# Altium schematic sheet DDR_Memory.SchDoc: DDR Memory
size A3; GitHash: VersionControl_ProjFolderRevNumber; Author: Carlos Barreiro; Organization: Escuela Técnica Superior de Ingeniería de Sistemas Informáticos de la Universidad Politécnica de Madrid; Address1: Campus Sur de la Universidad Politécnica de Madrid; Address2: Calle de Alan Turing, s/nº; Address3: Madrid 28031; Address4: España; Revision: 1.0; SheetNumber: 4; SheetTotal: 5
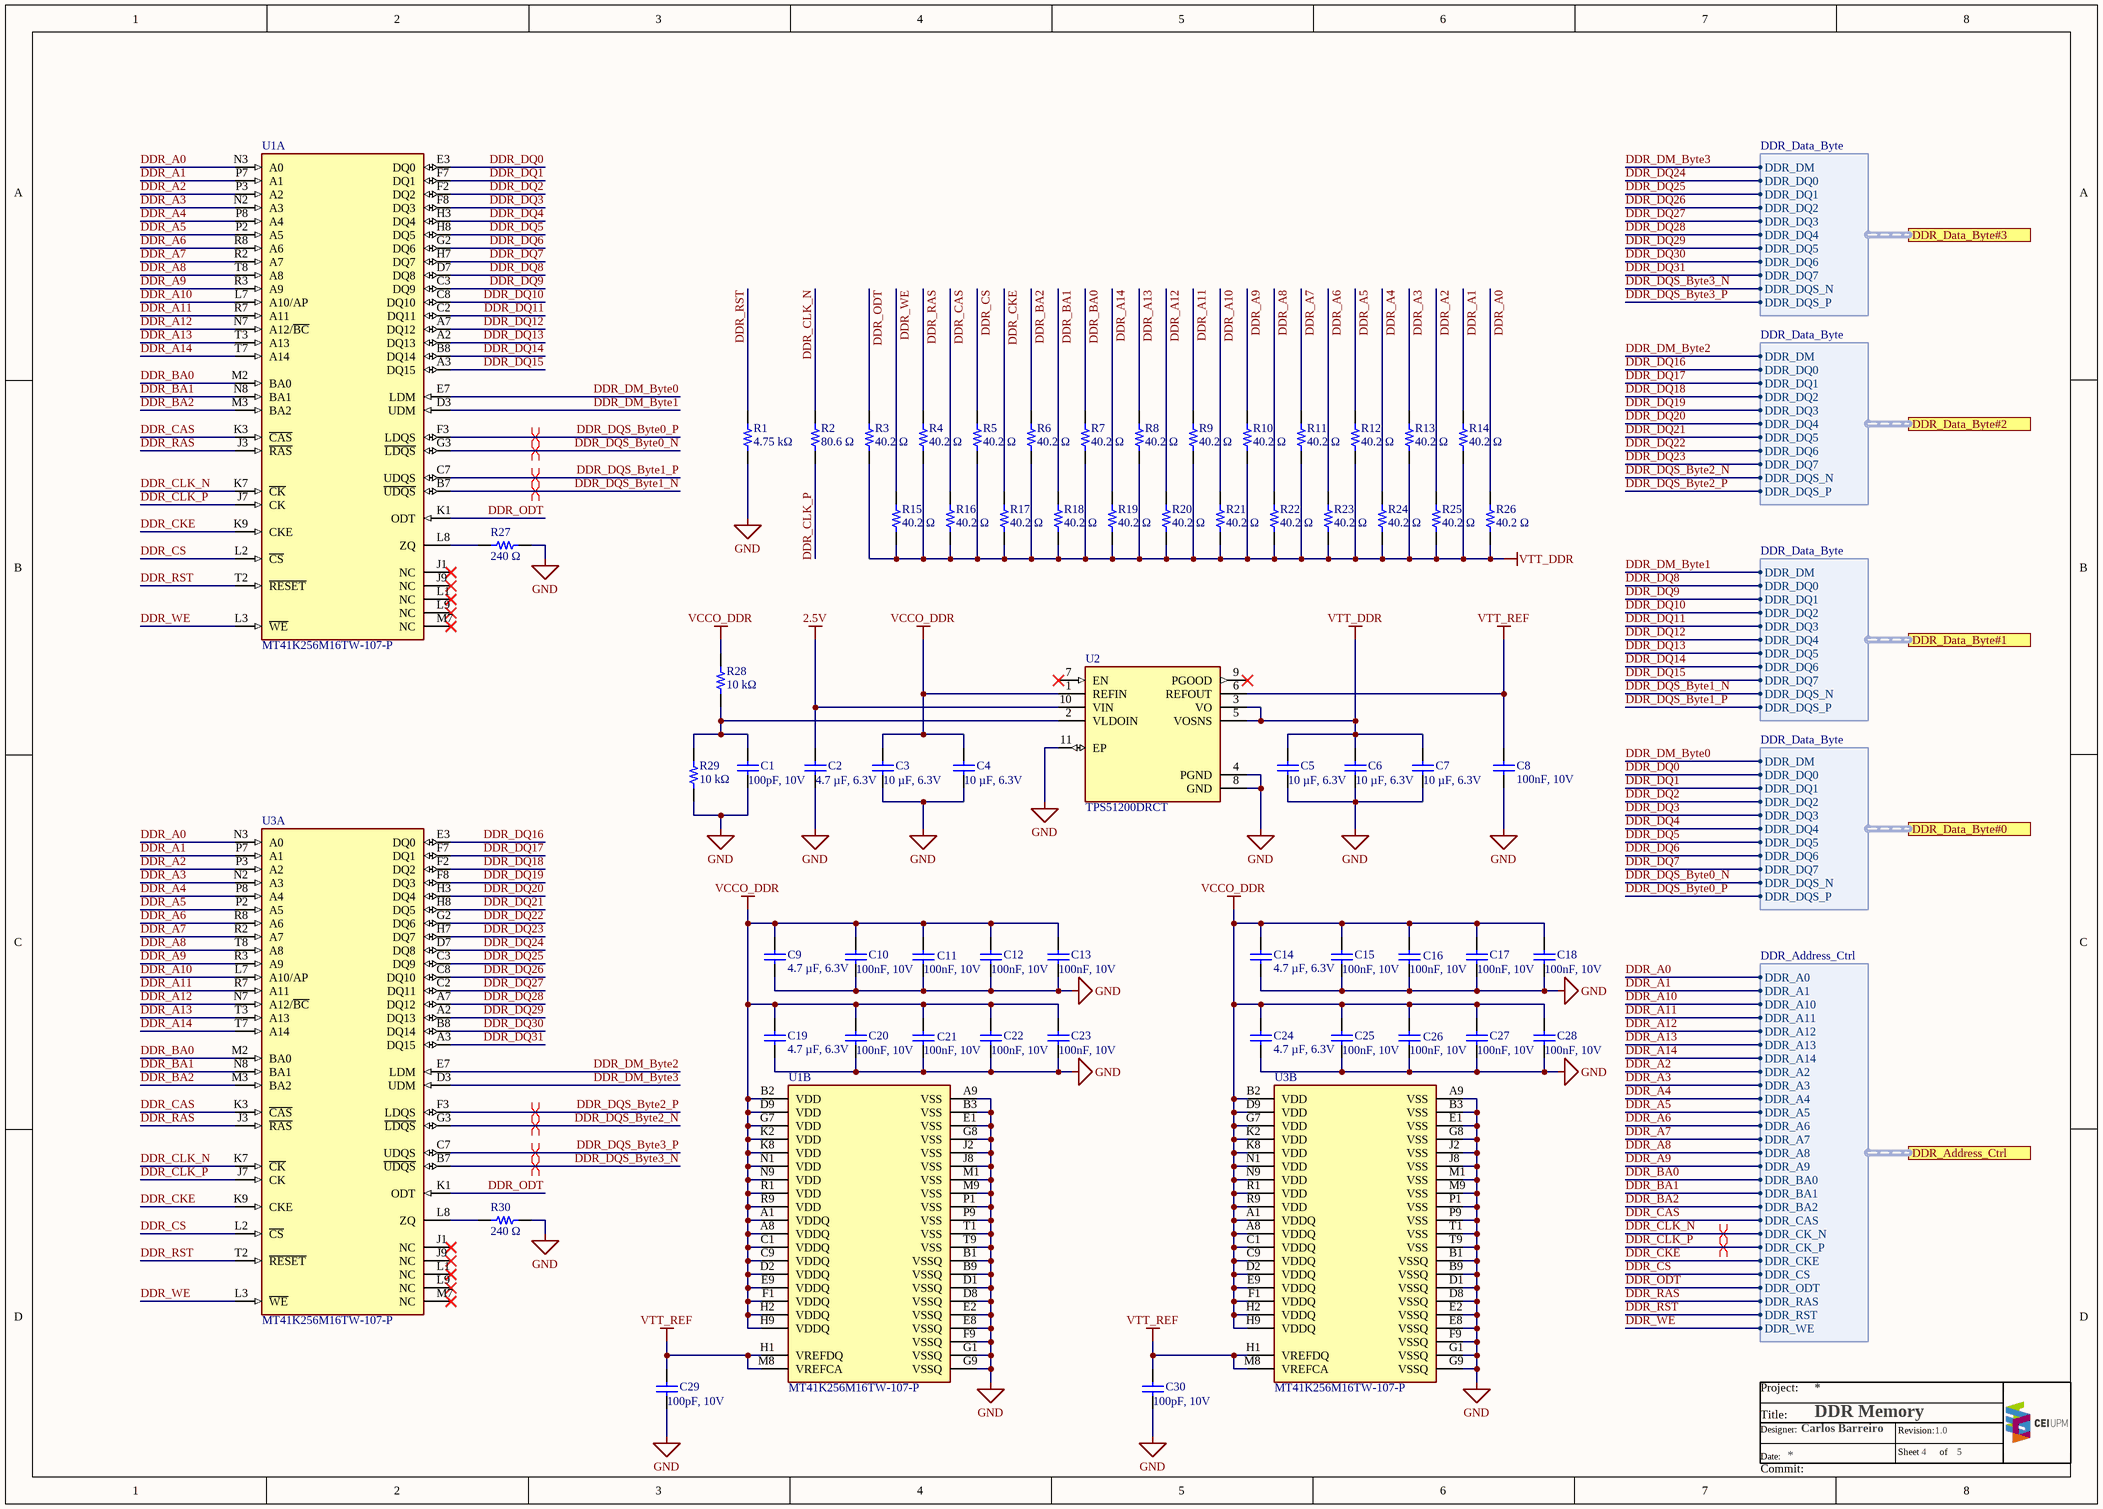
[diagram p0: DDR_Memory.SchDoc]

## Parts
C1  100pF, 10V  [WURTH_WCAP-CSGP_0402]
C2  4.7 µF, 6.3V  [WURTH_WCAP-CSGP_0402]
C3  10 µF, 6.3V  [WURTH_WCAP-CSGP_0402]
C4  10 µF, 6.3V  [WURTH_WCAP-CSGP_0402]
C5  10 µF, 6.3V  [WURTH_WCAP-CSGP_0402]
C6  10 µF, 6.3V  [WURTH_WCAP-CSGP_0402]
C7  10 µF, 6.3V  [WURTH_WCAP-CSGP_0402]
C8  100nF, 10V  [WURTH_WCAP-CSGP_0402]
C9  4.7 µF, 6.3V  [WURTH_WCAP-CSGP_0402]
C10  100nF, 10V  [WURTH_WCAP-CSGP_0402]
C11  100nF, 10V  [WURTH_WCAP-CSGP_0402]
C12  100nF, 10V  [WURTH_WCAP-CSGP_0402]
C13  100nF, 10V  [WURTH_WCAP-CSGP_0402]
C14  4.7 µF, 6.3V  [WURTH_WCAP-CSGP_0402]
C15  100nF, 10V  [WURTH_WCAP-CSGP_0402]
C16  100nF, 10V  [WURTH_WCAP-CSGP_0402]
C17  100nF, 10V  [WURTH_WCAP-CSGP_0402]
C18  100nF, 10V  [WURTH_WCAP-CSGP_0402]
C19  4.7 µF, 6.3V  [WURTH_WCAP-CSGP_0402]
C20  100nF, 10V  [WURTH_WCAP-CSGP_0402]
C21  100nF, 10V  [WURTH_WCAP-CSGP_0402]
C22  100nF, 10V  [WURTH_WCAP-CSGP_0402]
C23  100nF, 10V  [WURTH_WCAP-CSGP_0402]
C24  4.7 µF, 6.3V  [WURTH_WCAP-CSGP_0402]
C25  100nF, 10V  [WURTH_WCAP-CSGP_0402]
C26  100nF, 10V  [WURTH_WCAP-CSGP_0402]
C27  100nF, 10V  [WURTH_WCAP-CSGP_0402]
C28  100nF, 10V  [WURTH_WCAP-CSGP_0402]
C29  100pF, 10V  [WURTH_WCAP-CSGP_0402]
C30  100pF, 10V  [WURTH_WCAP-CSGP_0402]
R1  4.75 kΩ  [PANASONIC_ERJ2G_0402]
R2  80.6 Ω  [PANASONIC_ERJ2G_0402]
R3  40.2 Ω  [PANASONIC_ERJ2G_0402]
R4  40.2 Ω  [PANASONIC_ERJ2G_0402]
R5  40.2 Ω  [PANASONIC_ERJ2G_0402]
R6  40.2 Ω  [PANASONIC_ERJ2G_0402]
R7  40.2 Ω  [PANASONIC_ERJ2G_0402]
R8  40.2 Ω  [PANASONIC_ERJ2G_0402]
R9  40.2 Ω  [PANASONIC_ERJ2G_0402]
R10  40.2 Ω  [PANASONIC_ERJ2G_0402]
R11  40.2 Ω  [PANASONIC_ERJ2G_0402]
R12  40.2 Ω  [PANASONIC_ERJ2G_0402]
R13  40.2 Ω  [PANASONIC_ERJ2G_0402]
R14  40.2 Ω  [PANASONIC_ERJ2G_0402]
R15  40.2 Ω  [PANASONIC_ERJ2G_0402]
R16  40.2 Ω  [PANASONIC_ERJ2G_0402]
R17  40.2 Ω  [PANASONIC_ERJ2G_0402]
R18  40.2 Ω  [PANASONIC_ERJ2G_0402]
R19  40.2 Ω  [PANASONIC_ERJ2G_0402]
R20  40.2 Ω  [PANASONIC_ERJ2G_0402]
R21  40.2 Ω  [PANASONIC_ERJ2G_0402]
R22  40.2 Ω  [PANASONIC_ERJ2G_0402]
R23  40.2 Ω  [PANASONIC_ERJ2G_0402]
R24  40.2 Ω  [PANASONIC_ERJ2G_0402]
R25  40.2 Ω  [PANASONIC_ERJ2G_0402]
R26  40.2 Ω  [PANASONIC_ERJ2G_0402]
R27  240 Ω  [PANASONIC_ERJ2G_0402]
R28  10 kΩ  [PANASONIC_ERJ2G_0402]
R29  10 kΩ  [PANASONIC_ERJ2G_0402]
R30  240 Ω  [PANASONIC_ERJ2G_0402]
U1  MT41K256M16TW-107-P  [Micron_TW]  (parts A,B of 2)
U2  TPS51200DRCT  [TEXAS_VSON10]
U3  MT41K256M16TW-107-P  [Micron_TW]  (parts A,B of 2)

## Ports
DDR_Address_Ctrl (harness DDR_Address_Ctrl), DDR_Data_Byte#0 (harness DDR_Data_Byte), DDR_Data_Byte#1 (harness DDR_Data_Byte), DDR_Data_Byte#2 (harness DDR_Data_Byte), DDR_Data_Byte#3 (harness DDR_Data_Byte)

## Harnesses
DDR_Address_Ctrl: DDR_A0, DDR_A1, DDR_A10, DDR_A11, DDR_A12, DDR_A13, DDR_A14, DDR_A2, DDR_A3, DDR_A4, DDR_A5, DDR_A6, DDR_A7, DDR_A8, DDR_A9, DDR_BA0, DDR_BA1, DDR_BA2, DDR_CAS, DDR_CK_N, DDR_CK_P, DDR_CKE, DDR_CS, DDR_ODT, DDR_RAS, DDR_RST, DDR_WE
DDR_Data_Byte: DDR_DM, DDR_DQ0, DDR_DQ1, DDR_DQ2, DDR_DQ3, DDR_DQ4, DDR_DQ5, DDR_DQ6, DDR_DQ7, DDR_DQS_N, DDR_DQS_P

## Nets
2.5V: C2.2 U2.10(VIN)
GND: C1.1 C2.1 C3.1 C4.1 C5.1 C6.1 C7.1 C8.1 C9.1 C10.1 C11.1 C12.1 C13.1 C14.1 C15.1 C16.1 C17.1 C18.1 C19.1 C20.1 C21.1 C22.1 C23.1 C24.1 C25.1 C26.1 C27.1 C28.1 C29.1 C30.1 R1.2 R27.2 R29.1 R30.2 U1.A9(VSS) U1.B1(VSSQ) U1.B3(VSS) U1.B9(VSSQ) U1.D1(VSSQ) U1.D8(VSSQ) U1.E1(VSS) U1.E2(VSSQ) U1.E8(VSSQ) U1.F9(VSSQ) U1.G1(VSSQ) U1.G8(VSS) U1.G9(VSSQ) U1.J2(VSS) U1.J8(VSS) U1.M1(VSS) U1.M9(VSS) U1.P1(VSS) U1.P9(VSS) U1.T1(VSS) U1.T9(VSS) U2.4(PGND) U2.8(GND) U2.11(EP) U3.A9(VSS) U3.B1(VSSQ) U3.B3(VSS) U3.B9(VSSQ) U3.D1(VSSQ) U3.D8(VSSQ) U3.E1(VSS) U3.E2(VSSQ) U3.E8(VSSQ) U3.F9(VSSQ) U3.G1(VSSQ) U3.G8(VSS) U3.G9(VSSQ) U3.J2(VSS) U3.J8(VSS) U3.M1(VSS) U3.M9(VSS) U3.P1(VSS) U3.P9(VSS) U3.T1(VSS) U3.T9(VSS)
VCCO_DDR: C3.2 C4.2 C9.2 C10.2 C11.2 C12.2 C13.2 C14.2 C15.2 C16.2 C17.2 C18.2 C19.2 C20.2 C21.2 C22.2 C23.2 C24.2 C25.2 C26.2 C27.2 C28.2 R28.2 U1.A1(VDDQ) U1.A8(VDDQ) U1.B2(VDD) U1.C1(VDDQ) U1.C9(VDDQ) U1.D2(VDDQ) U1.D9(VDD) U1.E9(VDDQ) U1.F1(VDDQ) U1.G7(VDD) U1.H2(VDDQ) U1.H9(VDDQ) U1.K2(VDD) U1.K8(VDD) U1.N1(VDD) U1.N9(VDD) U1.R1(VDD) U1.R9(VDD) U2.1(REFIN) U3.A1(VDDQ) U3.A8(VDDQ) U3.B2(VDD) U3.C1(VDDQ) U3.C9(VDDQ) U3.D2(VDDQ) U3.D9(VDD) U3.E9(VDDQ) U3.F1(VDDQ) U3.G7(VDD) U3.H2(VDDQ) U3.H9(VDDQ) U3.K2(VDD) U3.K8(VDD) U3.N1(VDD) U3.N9(VDD) U3.R1(VDD) U3.R9(VDD)
VTT_DDR: C5.2 C6.2 C7.2 R3.2 R4.2 R5.2 R6.2 R7.2 R8.2 R9.2 R10.2 R11.2 R12.2 R13.2 R14.2 R15.2 R16.2 R17.2 R18.2 R19.2 R20.2 R21.2 R22.2 R23.2 R24.2 R25.2 R26.2 U2.3(VO) U2.5(VOSNS)
VTT_REF: C8.2 C29.2 C30.2 U1.H1(VREFDQ) U1.M8(VREFCA) U2.6(REFOUT) U3.H1(VREFDQ) U3.M8(VREFCA)
DDR_A0: R26.1 U1.N3(A0) U3.N3(A0) ; port DDR_Address_Ctrl.DDR_A0
DDR_A1: R14.1 U1.P7(A1) U3.P7(A1) ; port DDR_Address_Ctrl.DDR_A1
DDR_A2: R25.1 U1.P3(A2) U3.P3(A2) ; port DDR_Address_Ctrl.DDR_A2
DDR_A3: R13.1 U1.N2(A3) U3.N2(A3) ; port DDR_Address_Ctrl.DDR_A3
DDR_A4: R24.1 U1.P8(A4) U3.P8(A4) ; port DDR_Address_Ctrl.DDR_A4
DDR_A5: R12.1 U1.P2(A5) U3.P2(A5) ; port DDR_Address_Ctrl.DDR_A5
DDR_A6: R23.1 U1.R8(A6) U3.R8(A6) ; port DDR_Address_Ctrl.DDR_A6
DDR_A7: R11.1 U1.R2(A7) U3.R2(A7) ; port DDR_Address_Ctrl.DDR_A7
DDR_A8: R22.1 U1.T8(A8) U3.T8(A8) ; port DDR_Address_Ctrl.DDR_A8
DDR_A9: R10.1 U1.R3(A9) U3.R3(A9) ; port DDR_Address_Ctrl.DDR_A9
DDR_A10: R21.1 U1.L7(A10/AP) U3.L7(A10/AP) ; port DDR_Address_Ctrl.DDR_A10
DDR_A11: R9.1 U1.R7(A11) U3.R7(A11) ; port DDR_Address_Ctrl.DDR_A11
DDR_A12: R20.1 U1.N7(A12/~{BC}) U3.N7(A12/~{BC}) ; port DDR_Address_Ctrl.DDR_A12
DDR_A13: R8.1 U1.T3(A13) U3.T3(A13) ; port DDR_Address_Ctrl.DDR_A13
DDR_A14: R19.1 U1.T7(A14) U3.T7(A14) ; port DDR_Address_Ctrl.DDR_A14
DDR_BA0: R7.1 U1.M2(BA0) U3.M2(BA0) ; port DDR_Address_Ctrl.DDR_BA0
DDR_BA1: R18.1 U1.N8(BA1) U3.N8(BA1) ; port DDR_Address_Ctrl.DDR_BA1
DDR_BA2: R6.1 U1.M3(BA2) U3.M3(BA2) ; port DDR_Address_Ctrl.DDR_BA2
DDR_CAS: R16.1 U1.K3(~{CAS}) U3.K3(~{CAS}) ; port DDR_Address_Ctrl.DDR_CAS
DDR_CKE: R17.1 U1.K9(CKE) U3.K9(CKE) ; port DDR_Address_Ctrl.DDR_CKE
DDR_CLK_N: R2.2 U1.K7(~{CK}) U3.K7(~{CK}) ; port DDR_Address_Ctrl.DDR_CK_N
DDR_CLK_P: R2.1 U1.J7(CK) U3.J7(CK) ; port DDR_Address_Ctrl.DDR_CK_P
DDR_CS: R5.1 U1.L2(~{CS}) U3.L2(~{CS}) ; port DDR_Address_Ctrl.DDR_CS
DDR_DM_Byte0: U1.E7(LDM) ; port DDR_Data_Byte#0.DDR_DM
DDR_DM_Byte1: U1.D3(UDM) ; port DDR_Data_Byte#1.DDR_DM
DDR_DM_Byte2: U3.E7(LDM) ; port DDR_Data_Byte#2.DDR_DM
DDR_DM_Byte3: U3.D3(UDM) ; port DDR_Data_Byte#3.DDR_DM
DDR_DQ0: U1.E3(DQ0) ; port DDR_Data_Byte#0.DDR_DQ0
DDR_DQ1: U1.F7(DQ1) ; port DDR_Data_Byte#0.DDR_DQ1
DDR_DQ2: U1.F2(DQ2) ; port DDR_Data_Byte#0.DDR_DQ2
DDR_DQ3: U1.F8(DQ3) ; port DDR_Data_Byte#0.DDR_DQ3
DDR_DQ4: U1.H3(DQ4) ; port DDR_Data_Byte#0.DDR_DQ4
DDR_DQ5: U1.H8(DQ5) ; port DDR_Data_Byte#0.DDR_DQ5
DDR_DQ6: U1.G2(DQ6) ; port DDR_Data_Byte#0.DDR_DQ6
DDR_DQ7: U1.H7(DQ7) ; port DDR_Data_Byte#0.DDR_DQ7
DDR_DQ8: U1.D7(DQ8) ; port DDR_Data_Byte#1.DDR_DQ0
DDR_DQ9: U1.C3(DQ9) ; port DDR_Data_Byte#1.DDR_DQ1
DDR_DQ10: U1.C8(DQ10) ; port DDR_Data_Byte#1.DDR_DQ2
DDR_DQ11: U1.C2(DQ11) ; port DDR_Data_Byte#1.DDR_DQ3
DDR_DQ12: U1.A7(DQ12) ; port DDR_Data_Byte#1.DDR_DQ4
DDR_DQ13: U1.A2(DQ13) ; port DDR_Data_Byte#1.DDR_DQ5
DDR_DQ14: U1.B8(DQ14) ; port DDR_Data_Byte#1.DDR_DQ6
DDR_DQ15: U1.A3(DQ15) ; port DDR_Data_Byte#1.DDR_DQ7
DDR_DQ16: U3.E3(DQ0) ; port DDR_Data_Byte#2.DDR_DQ0
DDR_DQ17: U3.F7(DQ1) ; port DDR_Data_Byte#2.DDR_DQ1
DDR_DQ18: U3.F2(DQ2) ; port DDR_Data_Byte#2.DDR_DQ2
DDR_DQ19: U3.F8(DQ3) ; port DDR_Data_Byte#2.DDR_DQ3
DDR_DQ20: U3.H3(DQ4) ; port DDR_Data_Byte#2.DDR_DQ4
DDR_DQ21: U3.H8(DQ5) ; port DDR_Data_Byte#2.DDR_DQ5
DDR_DQ22: U3.G2(DQ6) ; port DDR_Data_Byte#2.DDR_DQ6
DDR_DQ23: U3.H7(DQ7) ; port DDR_Data_Byte#2.DDR_DQ7
DDR_DQ24: U3.D7(DQ8) ; port DDR_Data_Byte#3.DDR_DQ0
DDR_DQ25: U3.C3(DQ9) ; port DDR_Data_Byte#3.DDR_DQ1
DDR_DQ26: U3.C8(DQ10) ; port DDR_Data_Byte#3.DDR_DQ2
DDR_DQ27: U3.C2(DQ11) ; port DDR_Data_Byte#3.DDR_DQ3
DDR_DQ28: U3.A7(DQ12) ; port DDR_Data_Byte#3.DDR_DQ4
DDR_DQ29: U3.A2(DQ13) ; port DDR_Data_Byte#3.DDR_DQ5
DDR_DQ30: U3.B8(DQ14) ; port DDR_Data_Byte#3.DDR_DQ6
DDR_DQ31: U3.A3(DQ15) ; port DDR_Data_Byte#3.DDR_DQ7
DDR_DQS_Byte0_N: U1.G3(~{LDQS}) ; port DDR_Data_Byte#0.DDR_DQS_N
DDR_DQS_Byte0_P: U1.F3(LDQS) ; port DDR_Data_Byte#0.DDR_DQS_P
DDR_DQS_Byte1_N: U1.B7(~{UDQS}) ; port DDR_Data_Byte#1.DDR_DQS_N
DDR_DQS_Byte1_P: U1.C7(UDQS) ; port DDR_Data_Byte#1.DDR_DQS_P
DDR_DQS_Byte2_N: U3.G3(~{LDQS}) ; port DDR_Data_Byte#2.DDR_DQS_N
DDR_DQS_Byte2_P: U3.F3(LDQS) ; port DDR_Data_Byte#2.DDR_DQS_P
DDR_DQS_Byte3_N: U3.B7(~{UDQS}) ; port DDR_Data_Byte#3.DDR_DQS_N
DDR_DQS_Byte3_P: U3.C7(UDQS) ; port DDR_Data_Byte#3.DDR_DQS_P
DDR_ODT: R3.1 U1.K1(ODT) U3.K1(ODT) ; port DDR_Address_Ctrl.DDR_ODT
DDR_RAS: R4.1 U1.J3(~{RAS}) U3.J3(~{RAS}) ; port DDR_Address_Ctrl.DDR_RAS
DDR_RST: R1.1 U1.T2(~{RESET}) U3.T2(~{RESET}) ; port DDR_Address_Ctrl.DDR_RST
DDR_WE: R15.1 U1.L3(~{WE}) U3.L3(~{WE}) ; port DDR_Address_Ctrl.DDR_WE
NetC1_2: C1.2 R28.1 R29.2 U2.2(VLDOIN)
NetR27_1: R27.1 U1.L8(ZQ)
NetR30_1: R30.1 U3.L8(ZQ)

Not connected (* = marked no-connect by the designer): U1 J1(NC)* J9(NC)* L1(NC)* L9(NC)* M7(NC)*; U2 7(EN)* 9(PGOOD)*; U3 J1(NC)* J9(NC)* L1(NC)* L9(NC)* M7(NC)*

## Layout directives
differential pair: DDR_CLK_N, DDR_CLK_P, DDR_DQS_Byte0_N, DDR_DQS_Byte0_P, DDR_DQS_Byte1_N, DDR_DQS_Byte1_P, DDR_DQS_Byte2_N, DDR_DQS_Byte2_P, DDR_DQS_Byte3_N, DDR_DQS_Byte3_P

## Notes on the sheet
- Project:
- Title:
- Date:
- Designer:
- Sheet
- Revision:
- of
- Commit:

## Library data of the parts
C1 C29 C30 = 885012005013: WCAP-CSGP Multilayer Ceramic Chip Capacitor, General Purpose, size 0402, NP0, 100pF, 10V; Manufacturer: Wurth Elektronik; Rated Voltage: 10VDC; Isolation Resistance  min.: 10GOhm; Capacitance Tolerance: +/-5%; Technical Reference: NP00402101J010DFCT10000; Q-Factor min.: 1000; ComponentLink1Description: Manufacturer; ComponentLink1URL: http://www.we-online.de; ComponentLink2Description: Datasheet; ComponentLink2URL: https://www.we-online.com/catalog/datasheet/885012005013.pdf; Operating Temperature: -55 to +125degC; Packaging: Tape and Reel; Manufacturer Part Number: 885012005013; Published Date: April 2021; Ceramic Type: NP0; Dissipation Factor max.: -; Height: 0.5mm; Mounting Technology: SMT; Size: 0402; Capacitance: 100pF
C2 C9 C14 C19 C24 = GRM155C80J475MEAAD: Multilayer Ceramic Capacitors MLCC, size 0402, X5R, 4.7 µF, 6.3V; Manufacturer: Murata; Rated Voltage: 6.3VDC; Ceramic Type: X6S; Capacitance Tolerance: +/-20%; Dissipation Factor max.: 10%; Capacitance: 4.7 µF; Operating Temperature: -55 to +105degC; Packaging: Tape and Reel; Manufacturer Part Number: GRM155C80J475MEAAD; Height: 0.5mm; Mounting Technology: SMT; Size: 0402; Supplier 1: Digi-Key; Supplier 2: Mouser; Supplier Part Number 1: 490-14458-1-ND; Supplier Part Number 2: 81-GRM155C80J475MEAD
C3-C7 = 885012105020: WCAP-CSGP Multilayer Ceramic Chip Capacitor, General Purpose, size 0402, X5R, 10uF, 6.3V; Manufacturer: Wurth Elektronik; Rated Voltage: 6.3VDC; Isolation Resistance  min.: 0.01GOhm; Capacitance Tolerance: +/20%; Dissipation Factor max.: 10%; Technical Reference: X5R0402106M6R3DFCT10000; ComponentLink1Description: Manufacturer; ComponentLink1URL: http://www.we-online.de; ComponentLink2Description: Datasheet; ComponentLink2URL: https://www.we-online.com/catalog/datasheet/885012105020.pdf; Operating Temperature: -55 to +85degC; Packaging: Tape and Reel; Manufacturer Part Number: 885012105020; Published Date: April 2021; Ceramic Type: X5R; Height: 0.5mm; Mounting Technology: SMT; Size: 0402; Capacitance: 10uF; Q-Factor min.: -
C8 C10-C13 C15-C18 C20-C23 C25-C28 = 885012205018: WCAP-CSGP Multilayer Ceramic Chip Capacitor, General Purpose, size 0402, X7R, 100nF, 10V; Manufacturer: Wurth Elektronik; Rated Voltage: 10VDC; Isolation Resistance  min.: 5GOhm; Capacitance Tolerance: +/-10%; Dissipation Factor max.: 5%; Technical Reference: X7R0402104K010DFCT10000; ComponentLink1Description: Manufacturer; ComponentLink1URL: http://www.we-online.de; ComponentLink2Description: Datasheet; ComponentLink2URL: https://www.we-online.com/catalog/datasheet/885012205018.pdf; Operating Temperature: -55 to +125degC; Packaging: Tape and Reel; Manufacturer Part Number: 885012205018; Published Date: April 2021; Ceramic Type: X7R; Height: 0.5mm; Mounting Technology: SMT; Size: 0402; Capacitance: 100nF; Q-Factor min.: -
R1 = ERJ2RKF4751X: General Purpose Thick Film Chip Resistors; Manufacturer: Panasonic; Power (0402): 0.1 W; Limiting Voltage (0402): 50; Maximum Voltage (0402): 100; Resistance Range (Ω): 1Ω to 100MΩ; AEC 200: Grade 0; Size (0402): 2GE; ComponentLink1Description: Catalog; ComponentLink1URL: https://industrial.panasonic.com/ww/products/pt/general-purpose-chip-resistors/models?op=search&model_status_current=1&page=0#model-list-search-results; Series: ERJ; Temperature Range (ºC): -55 to +155; Supplier 1: RSComponents; Supplier 2: Digi-Key; Supplier Part Number 1: 1065277; Supplier Part Number 2: P4.75KLCT-ND
R2 = ERJ2RKF80R6X: General Purpose Thick Film Chip Resistors; Manufacturer: Panasonic; Power (0402): 0.1 W; Limiting Voltage (0402): 50; Maximum Voltage (0402): 100; Resistance Range (Ω): 1Ω to 100MΩ; AEC 200: Grade 0; Size (0402): 2GE; ComponentLink1Description: Catalog; ComponentLink1URL: https://industrial.panasonic.com/ww/products/pt/general-purpose-chip-resistors/models?op=search&model_status_current=1&page=0#model-list-search-results; Series: ERJ; Temperature Range (ºC): -55 to +155; Supplier 1: Digi-Key; Supplier 2: Mouser; Supplier Part Number 1: P80.6LCT-ND; Supplier Part Number 2: 667-ERJ-2RKF80R6X
R3-R26 = ERJ2RKF40R2X: General Purpose Thick Film Chip Resistors; Manufacturer: Panasonic; Power (0402): 0.1 W; Limiting Voltage (0402): 50; Maximum Voltage (0402): 100; Resistance Range (Ω): 1Ω to 100MΩ; AEC 200: Grade 0; Size (0402): 2GE; ComponentLink1Description: Catalog; ComponentLink1URL: https://industrial.panasonic.com/ww/products/pt/general-purpose-chip-resistors/models?op=search&model_status_current=1&page=0#model-list-search-results; Series: ERJ; Temperature Range (ºC): -55 to +155; Supplier 1: Newark; Supplier 2: Digi-Key; Supplier Part Number 1: 27AC5044; Supplier Part Number 2: P40.2LCT-ND
R27 R30 = ERJ2GEJ241X: General Purpose Thick Film Chip Resistors; Manufacturer: Panasonic; Power (0402): 0.1 W; Limiting Voltage (0402): 50; Maximum Voltage (0402): 100; Resistance Range (Ω): 1Ω to 100MΩ; AEC 200: Grade 0; Size (0402): 2GE; ComponentLink1Description: Catalog; ComponentLink1URL: https://industrial.panasonic.com/ww/products/pt/general-purpose-chip-resistors/models?op=search&model_status_current=1&page=0#model-list-search-results; Series: ERJ; Temperature Range (ºC): -55 to +155; Supplier 1: Newark; Supplier 2: Mouser; Supplier Part Number 1: 85Y7936; Supplier Part Number 2: 667-ERJ-2GEJ241X
R28 R29 = ERJ2RKF1002X: General Purpose Thick Film Chip Resistors; Manufacturer: Panasonic; Power (0402): 0.1 W; Limiting Voltage (0402): 50; Maximum Voltage (0402): 100; Resistance Range (Ω): 1Ω to 100MΩ; AEC 200: Grade 0; Size (0402): 2GE; ComponentLink1Description: Catalog; ComponentLink1URL: https://industrial.panasonic.com/ww/products/pt/general-purpose-chip-resistors/models?op=search&model_status_current=1&page=0#model-list-search-results; Series: ERJ; Temperature Range (ºC): -55 to +155; Supplier 1: Digi-Key; Supplier 2: Mouser; Supplier Part Number 1: P10.0KLCT-ND; Supplier Part Number 2: 667-ERJ-2RKF1002X
U1 U3 = MT41K256M16TW-107-P: DDR3L SRAM 256Mb*16; Supplier 1: Digi-Key; Supplier 2: Mouser; Supplier Part Number 1: 557-1792-ND; Supplier Part Number 2: 340-265846-TRAY
U2 = TPS51200DRCT: 3A Sink/Source DDR Termination Regulator w/ VTTREF Buffered Reference for DDR2, DDR3, DDR3L and DDR4 10-VSON -40 to 85; MF: Texas Instruments; DDR memory type: DDR, DDR2, DDR3, DDR3L, LPDDR2, LPDDR3; Control mode: D-CAP, S4/S5; Iout VDDQ (Max) (A): 20; Iq (Typ) (mA): 0.6; Output: VDDQ, VREF, VTT; Vin (Min) (V): 3; Vin (Max) (V): 28; Rating: HiRel Enhanced Product; MP: TPS51200DRCT; Package: VSON-10; Supplier 1: Digi-Key; Supplier 2: Mouser; Supplier Part Number 1: 296-23830-1-ND; Supplier Part Number 2: 595-TPS51200DRCT; Iout VTT (Max) (A): *; Operating temperature range (C): -55ºC to 125ºC